# Altium schematic sheet [03] Codec.SchDoc: Codec
size A3; Author: Caner ALP; Organization: ALP Electronics; Address1: Axel Oxenstiernas; Address2: Västerås; Address3: 72478; Address4: Sweden; DocumentNumber: 4; SheetNumber: 4; SheetTotal: 7
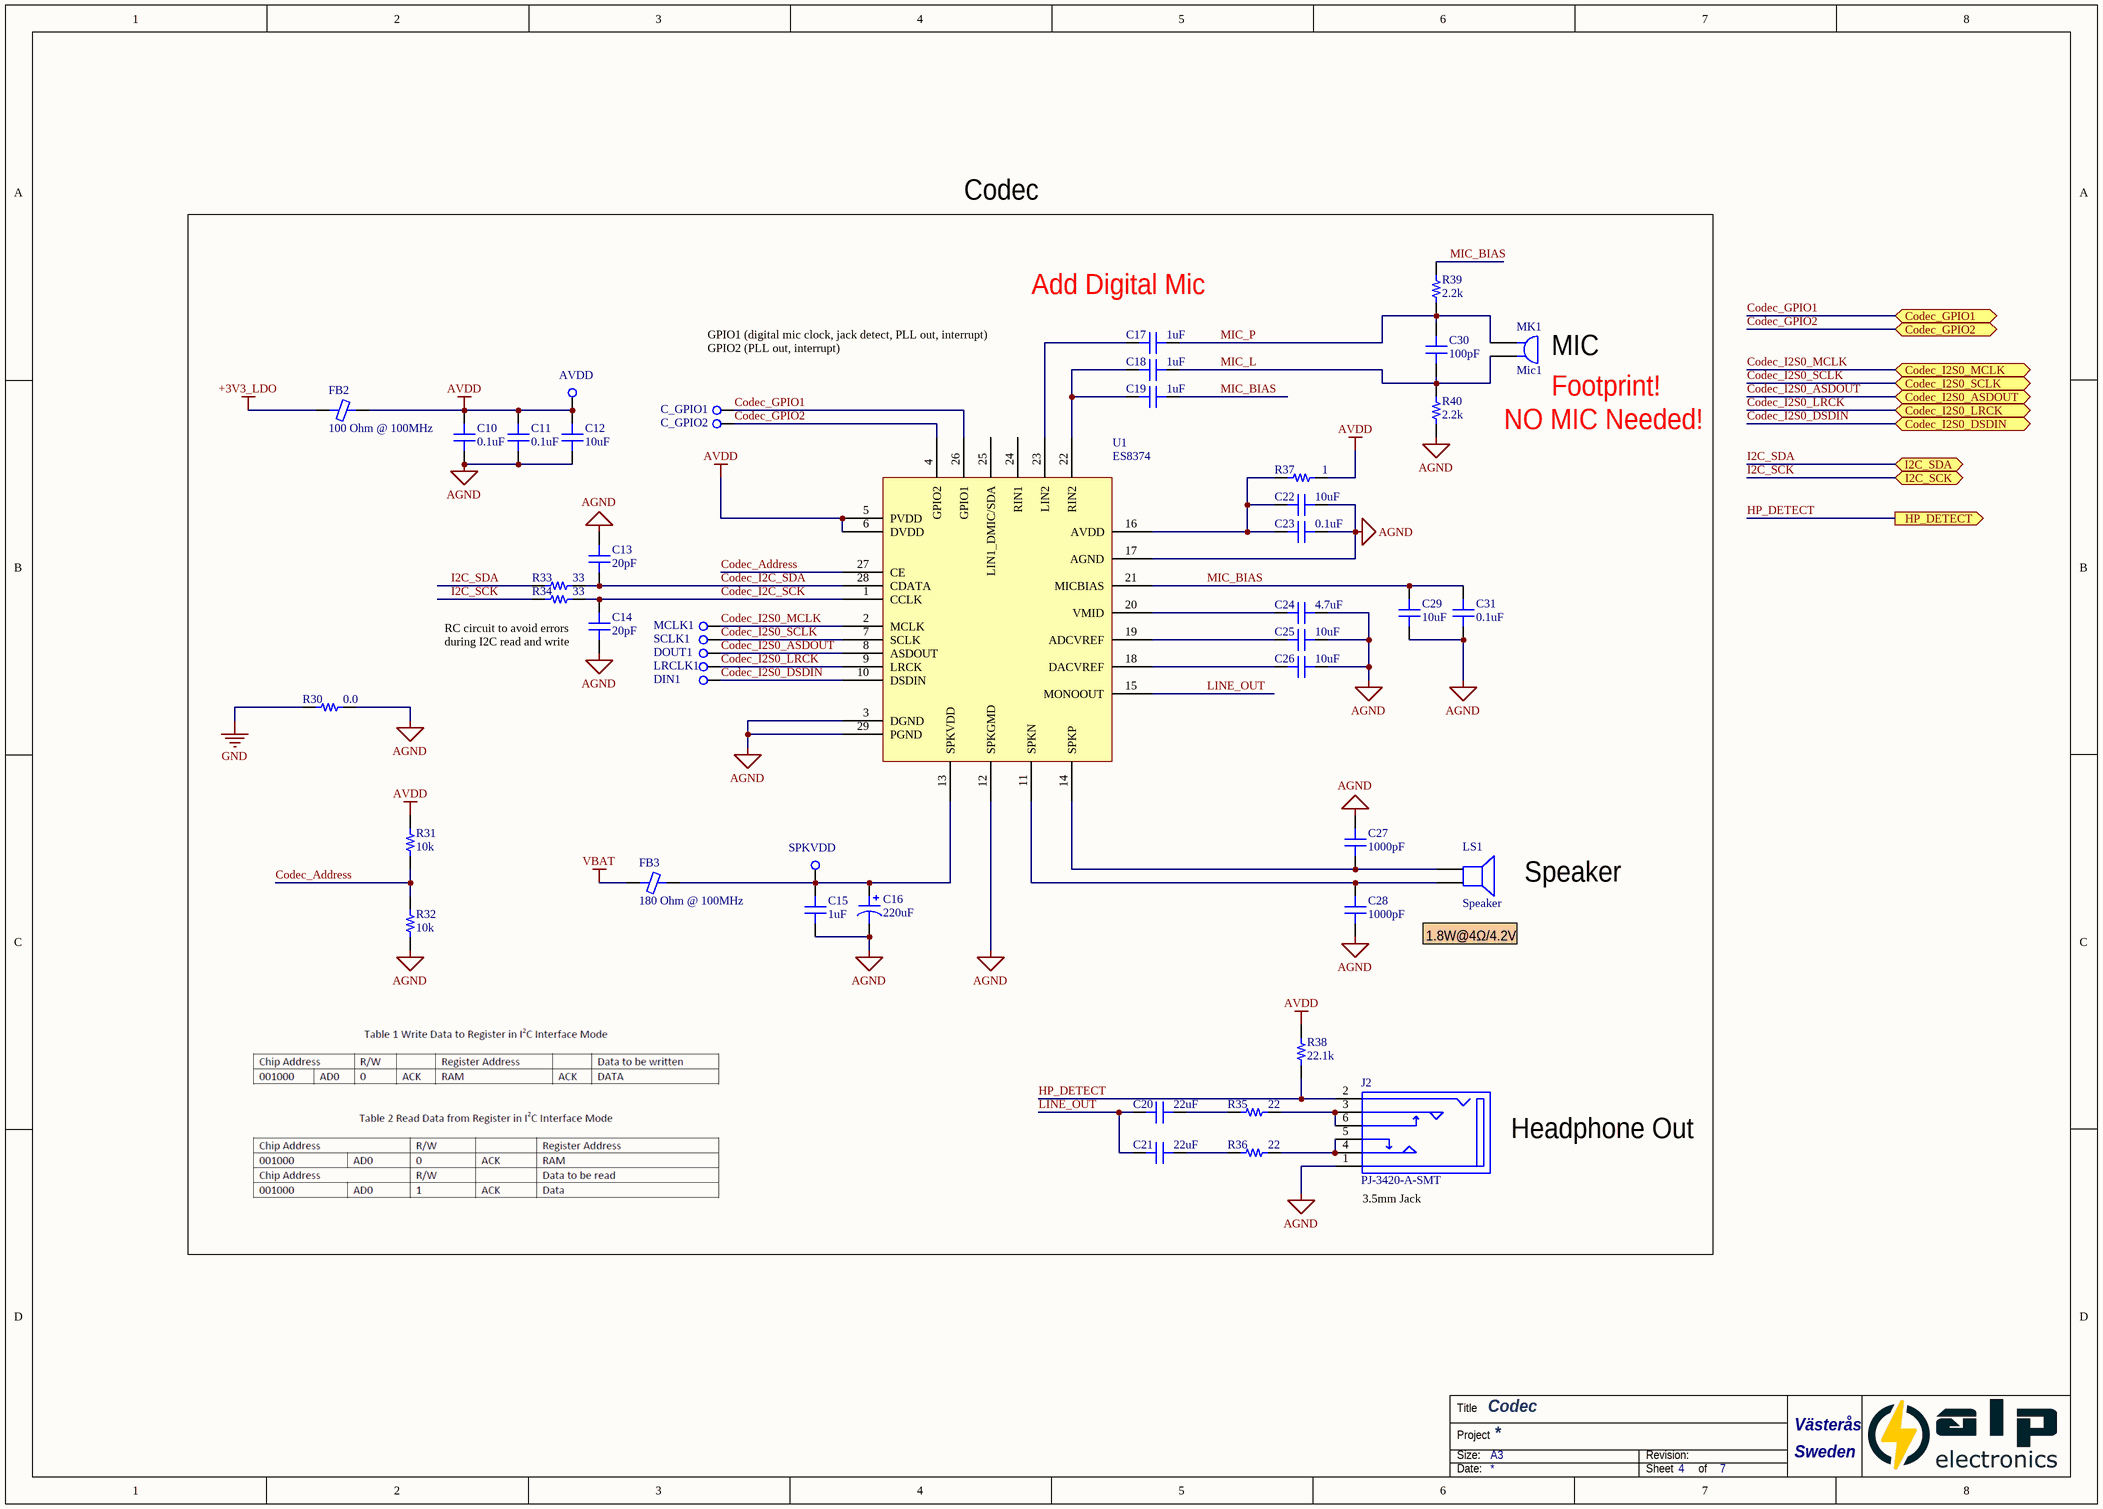
[diagram p0: [03] Codec.SchDoc]

## Parts
AVDD  RCT-0C  [0.5mm-TestPad]  (value not drawn)
C10  0.1uF  [CAP 0603/1608]
C11  0.1uF  [CAP 0603/1608]
C12  10uF  [CAP 0603/1608]
C13  20pF  [CAP 0402/1005]
C14  20pF  [CAP 0402/1005]
C15  1uF  [CAP 0603/1608]
C16  220uF  [CAP ALUM 6.6MM]
C17  1uF  [CAP 0603/1608]
C18  1uF  [CAP 0603/1608]
C19  1uF  [CAP 0603/1608]
C20  22uF  [CAP 0603/1608]
C21  22uF  [CAP 0603/1608]
C22  10uF  [CAP 0603/1608]
C23  0.1uF  [CAP 0603/1608]
C24  4.7uF  [CAP 0603/1608]
C25  10uF  [CAP 0603/1608]
C26  10uF  [CAP 0603/1608]
C27  1000pF  [CAP 0603/1608]
C28  1000pF  [CAP 0603/1608]
C29  10uF  [CAP 0603/1608]
C30  100pF  [CAP 0402/1005]
C31  0.1uF  [CAP 0603/1608]
C_GPIO1  RCT-0C  [0.5mm-TestPad]  (value not drawn)
C_GPIO2  RCT-0C  [0.5mm-TestPad]  (value not drawn)
DIN1  RCT-0C  [0.5mm-TestPad]  (value not drawn)
DOUT1  RCT-0C  [0.5mm-TestPad]  (value not drawn)
FB2  100 Ohm @ 100MHz  [FER 0805/2012]
FB3  180 Ohm @ 100MHz  [FER 0805/2012]
J2  PJ-3420-A-SMT  [PJ-3420-A-SMT]
LRCLK1  RCT-0C  [0.5mm-TestPad]  (value not drawn)
LS1  Speaker  [JST XH B2B-XH-A]
MCLK1  RCT-0C  [0.5mm-TestPad]  (value not drawn)
MK1  Mic1  [HDR1X2]
R30  0.0  [RES 0805/2012]
R31  10k  [RES 0402/1005]
R32  10k  [RES 0402/1005]
R33  33  [RES 0402/1005]
R34  33  [RES 0402/1005]
R35  22  [RES 0603/1608]
R36  22  [RES 0603/1608]
R37  1  [RES 0603/1608]
R38  22.1k  [RES 0402/1005]
R39  2.2k  [RES 0402/1005]
R40  2.2k  [RES 0402/1005]
SCLK1  RCT-0C  [0.5mm-TestPad]  (value not drawn)
SPKVDD  RCT-0C  [0.5mm-TestPad]  (value not drawn)
U1  ES8374  [QFN28 4x4mm 0.4mm Pitch]

## Ports
Codec_GPIO1 (bidir), Codec_GPIO2 (bidir), Codec_I2S0_ASDOUT (bidir), Codec_I2S0_DSDIN (bidir), Codec_I2S0_LRCK (bidir), Codec_I2S0_MCLK (bidir), Codec_I2S0_SCLK (bidir), HP_DETECT (out), I2C_SCK (bidir), I2C_SDA (bidir)

## Nets
+3V3_LDO: FB2.1
AGND: C10.1 C11.1 C12.1 C13.2 C14.1 C15.2 C16.2 C22.2 C23.1 C24.2 C25.2 C26.2 C27.2 C28.1 C29.1 C31.1 J2.1 R30.2 R32.1 R40.1 U1.3(DGND) U1.12(SPKGMD) U1.17(AGND) U1.29(PGND)
AVDD: AVDD.1(TP) C10.2 C11.2 C12.2 FB2.2 R31.2 R37.1 R38.2 U1.5(PVDD) U1.6(DVDD)
GND: R30.1
VBAT: FB3.1
Codec_Address: R31.1 R32.2 U1.27(CE)
Codec_GPIO1: C_GPIO1.1(TP) U1.26(GPIO1) ; port Codec_GPIO1
Codec_GPIO2: C_GPIO2.1(TP) U1.4(GPIO2) ; port Codec_GPIO2
Codec_I2C_SCK: C14.2 R34.2 U1.1(CCLK)
Codec_I2C_SDA: C13.1 R33.2 U1.28(CDATA)
Codec_I2S0_ASDOUT: DOUT1.1(TP) U1.8(ASDOUT) ; port Codec_I2S0_ASDOUT
Codec_I2S0_DSDIN: DIN1.1(TP) U1.10(DSDIN) ; port Codec_I2S0_DSDIN
Codec_I2S0_LRCK: LRCLK1.1(TP) U1.9(LRCK) ; port Codec_I2S0_LRCK
Codec_I2S0_MCLK: MCLK1.1(TP) U1.2(MCLK) ; port Codec_I2S0_MCLK
Codec_I2S0_SCLK: SCLK1.1(TP) U1.7(SCLK) ; port Codec_I2S0_SCLK
HP_DETECT: J2.2 R38.1 ; port HP_DETECT
I2C_SCK: R34.1 ; port I2C_SCK
I2C_SDA: R33.1 ; port I2C_SDA
LINE_OUT: C20.1 C21.1 U1.15(MONOOUT)
MIC_BIAS: C19.1 C29.2 C31.2 R39.2 U1.21(MICBIAS)
MIC_L: C18.1 C30.1 MK1.2 R40.2
MIC_P: C17.1 C30.2 MK1.1 R39.1
NetC15_1: C15.1 C16.1 FB3.2 SPKVDD.1(TP) U1.13(SPKVDD)
NetC17_2: C17.2 U1.23(LIN2)
NetC18_2: C18.2 C19.2 U1.22(RIN2)
NetC20_2: C20.2 R35.1
NetC21_2: C21.2 R36.1
NetC22_1: C22.1 C23.2 R37.2 U1.16(AVDD)
NetC24_1: C24.1 U1.20(VMID)
NetC25_1: C25.1 U1.19(ADCVREF)
NetC26_1: C26.1 U1.18(DACVREF)
NetC27_1: C27.1 LS1.1 U1.14(SPKP)
NetC28_2: C28.2 LS1.2 U1.11(SPKN)
NetJ2_3: J2.3 J2.6 R35.2
NetJ2_4: J2.4 J2.5 R36.2

Not connected (* = marked no-connect by the designer): U1 24(RIN1) 25(LIN1_DMIC/SDA)

## Notes on the sheet
- Codec
- (near C17) Add Digital Mic
- GPIO1 (digital mic clock, jack detect, PLL out, interrupt)
- GPIO2 (PLL out, interrupt)
- (near MK1) MIC
- NO MIC Needed!
- (near MK1) Footprint!
- RC circuit to avoid errors
  during I2C read and write
- Speaker
- (near LS1) 1.8W@4Ω/4.2V
- Headphone Out
- (near J2) 3.5mm Jack
- Title
- Size:
- Project
- A3
- Revision:
- Date:
- Sheet
- of

## Library data of the parts
AVDD C_GPIO1 C_GPIO2 DIN1 DOUT1 LRCLK1 MCLK1 SCLK1 SPKVDD = RCT-0C: 0805 PROBE PAD; Manufacturer: TE Connectivity AMP Connectors; Part Number: RCT-0C; PartId: 15704; Supplier 1: Digi-Key; Supplier Part Number 1: A106144CT-ND; ComponentLink1Description: Datasheet; ComponentLink1URL: http://www.te.com/commerce/DocumentDelivery/DDEController?Action=srchrtrv&DocNm=1773266&DocType=DS&DocLang=English; ComponentLink2Description: Digi-Key Listing; ComponentLink2URL: http://www.digikey.com/product-detail/en/te-connectivity-amp-connectors/RCT-0C/A106144CT-ND/3477801; Price: 0,14; Type: PC Test Point; Mounting Type: Surface Mount
C10 C11 C23 C31 = CC0603KPX7R7BB104: CAP CER 0.1UF 16V X7R 0603; Manufacturer: Yageo; TemperatureRange: -55C ~ 125C; Tolerance: 10%; Value: 0.1uF; Part Number: CC0603KPX7R7BB104; PartId: 5262; Supplier 1: Digi-Key; Supplier Part Number 1: 311-1335-2-ND; ComponentLink1Description: Datasheet; ComponentLink1URL: http://www.yageo.com/documents/recent/UPY-GPHC_X7R_6.3V-to-50V-v12.pdf; ComponentLink2Description: Digi-Key listing; ComponentLink2URL: http://digikey.com/product-detail/en/CC0603KPX7R7BB104/311-1335-2-ND/2103073; TemperatureCoefficient: X7R; Voltage: 16V; Price: 0,0043; Type: -; Device Package: 0603 (1608 Metric)
C12 C22 C25 C26 C29 = C1608X5R1A106M080AC: CAP CER 10UF 10V X5R 0603; Manufacturer: TDK Corporation; TemperatureRange: -55C ~ 85C; Tolerance: 20%; Value: 10uF; Part Number: C1608X5R1A106M080AC; PartId: 13099; Supplier 1: Digi-Key; Supplier Part Number 1: 445-6853-2-ND; ComponentLink1Description: Datasheet; ComponentLink1URL: https://product.tdk.com/info/en/catalog/datasheets/mlcc_commercial_general_en.pdf; ComponentLink2Description: Digi-Key Listing; ComponentLink2URL: https://www.digikey.com/product-detail/en/tdk-corporation/C1608X5R1A106M080AC/445-6853-2-ND/2619194; TemperatureCoefficient: X5R; Voltage: 10V; Price: 0,0935; Device Package: 0603 (1608 Metric)
C13 C14 = GRM1555C1E200JA01D: CAP CER 20PF 25V NP0 0402; Manufacturer: Murata Electronics North America; TemperatureRange: -55C ~ 125C; TemperatureCoefficient: C0G, NP0; Tolerance: 5%; Value: 20pF; Part Number: GRM1555C1E200JA01D; PartId: 5066; Supplier 1: Digi-Key; Supplier Part Number 1: 490-11364-2-ND; ComponentLink1Description: Datasheet; ComponentLink1URL: http://www.murata.com/~/media/webrenewal/support/library/catalog/products/capacitor/mlcc/c02e.ashx; ComponentLink2Description: Digi-Key listing; ComponentLink2URL: http://digikey.com/product-detail/en/GRM1555C1E200JA01D/490-11364-2-ND/3693725; Voltage: 25V; Price: 0,0118; Type: -; Device Package: 0402 (1005 Metric)
C15 C17-C19 = CGB3B1X7R1A105K055AC: CAP CER 1UF 10V X7R 0603; Manufacturer: TDK Corporation; TemperatureRange: -55C ~ 125C; Tolerance: 10%; Type: Low Profile; Value: 1uF; Part Number: CGB3B1X7R1A105K055AC; PartId: 4131; Supplier 1: Digi-Key; Supplier Part Number 1: 445-13228-1-ND; ComponentLink1Description: Datasheet; ComponentLink1URL: https://product.tdk.com/info/en/catalog/datasheets/mlcc_commercial_lowprofile_en.pdf; ComponentLink2Description: Digi-Key listing; ComponentLink2URL: http://digikey.com/product-detail/en/CGB3B1X7R1A105K055AC/445-13228-1-ND/3954894; TemperatureCoefficient: X7R; Voltage: 10V; Price: 0,27; Device Package: 0603 (1608 Metric)
C16 = EEE-1CA221XP: CAP ALUM 220UF 20% 16V SMD; Manufacturer: Panasonic Electronic Components; TemperatureRange: -40C ~ 85C; Type: Automotive; Ripple Current: 162mA; Lifetime @ Temp: 2000 Hrs @ 85C; Value: 220uF; Part Number: EEE-1CA221XP; PartId: 7248; Supplier 1: Digi-Key; Supplier Part Number 1: PCE3885TR-ND; ComponentLink1Description: Datasheet; ComponentLink1URL: http://media.digikey.com/pdf/Data%20Sheets/Panasonic%20Electronic%20Components/S_Series_Type_V.pdf; ComponentLink2Description: Digi-Key listing; ComponentLink2URL: http://digikey.com/product-detail/en/EEE-1CA221XP/PCE3885TR-ND/766052; Tolerance: 20%; Voltage: 16V; Price: 0,1758; Device Package: Radial, Can - SMD; Impedance: -
C20 C21 = C1608X5R1A226M080AC: CAP CER 22UF 10V X5R 0603; Manufacturer: TDK Corporation; TemperatureRange: -55C ~ 85C; Tolerance: 20%; Value: 22uF; Part Number: C1608X5R1A226M080AC; PartId: 12987; Supplier 1: Digi-Key; Supplier Part Number 1: 445-9077-2-ND; ComponentLink1Description: Datasheet; ComponentLink1URL: https://product.tdk.com/info/en/catalog/datasheets/mlcc_commercial_general_en.pdf; ComponentLink2Description: Digi-Key Listing; ComponentLink2URL: https://www.digikey.com/product-detail/en/tdk-corporation/C1608X5R1A226M080AC/445-9077-2-ND/3661560; TemperatureCoefficient: X5R; Voltage: 10V; Price: 0,105; Device Package: 0603 (1608 Metric)
C24 = C1608X5R1A475K080AC: CAP CER 4.7UF 10V X5R 0603; Manufacturer: TDK Corporation; TemperatureRange: -55C ~ 85C; Tolerance: 10%; Value: 4.7uF; Part Number: C1608X5R1A475K080AC; PartId: 13010; Supplier 1: Digi-Key; Supplier Part Number 1: 445-5170-2-ND; ComponentLink1Description: Datasheet; ComponentLink1URL: https://product.tdk.com/info/en/catalog/datasheets/mlcc_commercial_general_en.pdf; ComponentLink2Description: Digi-Key Listing; ComponentLink2URL: https://www.digikey.com/product-detail/en/tdk-corporation/C1608X5R1A475K080AC/445-5170-2-ND/2093438; TemperatureCoefficient: X5R; Voltage: 10V; Price: 0,0333; Device Package: 0603 (1608 Metric)
C27 C28 = C0603C102K3RACTU: CAP CER 1000PF 25V X7R 0603; Manufacturer: Kemet; TemperatureRange: -55C ~ 125C; Tolerance: 10%; Value: 1000pF; Part Number: C0603C102K3RACTU; PartId: 13145; Supplier 1: Digi-Key; Supplier Part Number 1: 399-7834-2-ND; ComponentLink1Description: Datasheet; ComponentLink1URL: http://www.kemet.com/docfinder?Partnumber=C0603C102K3RACTU; ComponentLink2Description: Digi-Key Listing; ComponentLink2URL: https://www.digikey.com/product-detail/en/kemet/C0603C102K3RACTU/399-7834-2-ND/2199718; TemperatureCoefficient: X7R; Voltage: 25V; Price: 0,0041; Device Package: 0603 (1608 Metric)
C30 = C0402C101J3GACTU: CAP CER 100PF 25V NP0 0402; Manufacturer: Kemet; TemperatureRange: -55C ~ 125C; TemperatureCoefficient: C0G, NP0; Tolerance: 5%; Value: 100pF; Part Number: C0402C101J3GACTU; PartId: 12375; Supplier 1: Digi-Key; Supplier Part Number 1: 399-1022-2-ND; ComponentLink1Description: Datasheet; ComponentLink1URL: http://www.kemet.com/docfinder?Partnumber=C0402C101J3GACTU; ComponentLink2Description: Digi-Key Listing; ComponentLink2URL: https://www.digikey.com/product-detail/en/kemet/C0402C101J3GACTU/399-1022-2-ND/411024; Voltage: 25V; Price: 0,0046; Device Package: 0402 (1005 Metric)
FB2 = CIC21P101NE: FERRITE CHIP 100 OHM 2000MA 0805; Manufacturer: Samsung Electro-Mechanics America, Inc.; Type: Differential Mode - Single; DC Resistance: 20 mOhm Max; Current Rating: 2A; Part Number: CIC21P101NE; PartId: 6759; Value: 100 Ohm @ 100MHz; Supplier 1: Digi-Key; Supplier Part Number 1: 1276-6374-2-ND; ComponentLink1Description: Datasheet; ComponentLink1URL: http://www.samsungsem.com/kr/front/downloadcms.do?path=/kr/support/product-search/bead/__icsFiles/afieldfile/2014/11/13&fileName=S_CIC21J121NE.pdf; ComponentLink2Description: Digi-Key listing; ComponentLink2URL: http://digikey.com/product-detail/en/CIC21P101NE/1276-6374-2-ND/3973735; Price: 0,0163; Device Package: 0805 (2012 Metric)
FB3 = MMZ2012S181AT000: FERRITE CHIP 180 OHM 600MA 0805; Manufacturer: TDK Corporation; Type: Differential Mode - Single; DC Resistance: 150 mOhm Max; Part Number: MMZ2012S181AT000; PartId: 6805; Value: 180 Ohm @ 100MHz; Supplier 1: Digi-Key; Supplier Part Number 1: 445-2194-2-ND; ComponentLink1Description: Datasheet; ComponentLink1URL: https://product.tdk.com/info/en/catalog/datasheets/beads_commercial_signal_mmz2012_en.pdf; ComponentLink2Description: Digi-Key listing; ComponentLink2URL: http://digikey.com/product-detail/en/MMZ2012S181AT000/445-2194-2-ND/600551; Price: 0,0344; Device Package: 0805 (2012 Metric); Current Rating: 600mA
LS1 = Speaker: Loudspeaker; Published: 24-Mar-1999; LatestRevisionDate: 17-Jul-2002; LatestRevisionNote: Re-released for DXP Platform.; PackageReference: PIN2; Publisher: Altium Limited
MK1 = Mic1: Microphone; Published: 24-Mar-1999; LatestRevisionDate: 17-Jul-2002; LatestRevisionNote: Re-released for DXP Platform.; PackageReference: PIN2; Publisher: Altium Limited
R30 = CR0805-J/-000ELF: RES SMD 0.0 OHM JUMPER 1/8W 0805; Manufacturer: Bourns Inc.; TemperatureRange: -55C ~ 155C; PowerRating: 0.125W, 1/8W; Value: 0.0; Part Number: CR0805-J/-000ELF; PartId: 16155; Supplier 1: Digi-Key; Supplier Part Number 1: CR0805-J/-000ELFTR-ND; ComponentLink1Description: Datasheet; ComponentLink1URL: http://www.bourns.com/docs/Product-Datasheets/CHPREZTR.pdf; ComponentLink2Description: Digi-Key Listing; ComponentLink2URL: https://www.digikey.com/product-detail/en/bourns-inc/CR0805-J%2F-000ELF/CR0805-J%2F-000ELFTR-ND/3593157; Tolerance: Jumper; Price: 0,011; Device Package: 0805 (2012 Metric)
R31 R32 = RC0402JR-0710KL: RES SMD 10K OHM 5% 1/16W 0402; Manufacturer: Yageo; TemperatureRange: -55C ~ 155C; TemperatureCoefficient: 100ppm/C; PowerRating: 0.063W, 1/16W; Value: 10k; Part Number: RC0402JR-0710KL; PartId: 14464; Supplier 1: Digi-Key; Supplier Part Number 1: 311-10KJRTR-ND; ComponentLink1Description: Datasheet; ComponentLink1URL: http://www.yageo.com/documents/recent/PYu-RC_Group_51_RoHS_L_04.pdf; ComponentLink2Description: Digi-Key Listing; ComponentLink2URL: https://www.digikey.com/product-detail/en/yageo/RC0402JR-0710KL/311-10KJRTR-ND/726418; Tolerance: 5%; Price: 0,0017; Device Package: 0402 (1005 Metric)
R33 R34 = ERJ-2GEJ330X: RES SMD 33 OHM 5% 1/10W 0402; Manufacturer: Panasonic Electronic Components; TemperatureRange: -55C ~ 155C; TemperatureCoefficient: 200ppm/C; PowerRating: 0.1W, 1/10W; Value: 33; Part Number: ERJ-2GEJ330X; PartId: 10984; Supplier 1: Digi-Key; Supplier Part Number 1: P33JTR-ND; ComponentLink1Description: Datasheet; ComponentLink1URL: http://industrial.panasonic.com/www-cgi/jvcr13pz.cgi?E+PZ+3+AOA0001+ERJ2GEJ330X+7+WW; ComponentLink2Description: Digi-Key Listing; ComponentLink2URL: https://www.digikey.com/product-detail/en/panasonic-electronic-components/ERJ-2GEJ330X/P33JTR-ND/146980; Tolerance: 5%; Price: 0,0019; Device Package: 0402 (1005 Metric)
R35 R36 = ERJ-3GEYJ220V: RES SMD 22 OHM 5% 1/10W 0603; Manufacturer: Panasonic Electronic Components; TemperatureRange: -55C ~ 155C; TemperatureCoefficient: 200ppm/C; PowerRating: 0.1W, 1/10W; Value: 22; Part Number: ERJ-3GEYJ220V; PartId: 11193; Supplier 1: Digi-Key; Supplier Part Number 1: P22GTR-ND; ComponentLink1Description: Datasheet; ComponentLink1URL: http://industrial.panasonic.com/www-cgi/jvcr13pz.cgi?E+PZ+3+AOA0001+ERJ3GEYJ220V+7+WW; ComponentLink2Description: Digi-Key Listing; ComponentLink2URL: https://www.digikey.com/product-detail/en/panasonic-electronic-components/ERJ-3GEYJ220V/P22GTR-ND/135600; Tolerance: 5%; Price: 0,002; Device Package: 0603 (1608 Metric)
R37 = ERJ-3GEYJ1R0V: RES SMD 1 OHM 5% 1/10W 0603; Manufacturer: Panasonic Electronic Components; TemperatureRange: -55C ~ 155C; TemperatureCoefficient: -100/ +600ppm/C; PowerRating: 0.1W, 1/10W; Value: 1; Part Number: ERJ-3GEYJ1R0V; PartId: 11204; Supplier 1: Digi-Key; Supplier Part Number 1: P1.0GTR-ND; ComponentLink1Description: Datasheet; ComponentLink1URL: http://industrial.panasonic.com/www-cgi/jvcr13pz.cgi?E+PZ+3+AOA0001+ERJ3GEYJ1R0V+7+WW; ComponentLink2Description: Digi-Key Listing; ComponentLink2URL: https://www.digikey.com/product-detail/en/panasonic-electronic-components/ERJ-3GEYJ1R0V/P1.0GTR-ND/282111; Tolerance: 5%; Price: 0,002; Device Package: 0603 (1608 Metric)
R38 = ERJ-2RKF2212X: RES SMD 22.1K OHM 1% 1/10W 0402; Manufacturer: Panasonic Electronic Components; TemperatureRange: -55C ~ 155C; TemperatureCoefficient: 100ppm/C; PowerRating: 0.1W, 1/10W; Value: 22.1k; Part Number: ERJ-2RKF2212X; PartId: 234; Supplier 1: Digi-Key; Supplier Part Number 1: P22.1KLTR-ND; ComponentLink1Description: Datasheet; ComponentLink1URL: http://industrial.panasonic.com/www-cgi/jvcr13pz.cgi?E+PZ+3+AOA0002+ERJ2RKF2212X+7+WW; ComponentLink2Description: Digikey listing; ComponentLink2URL: http://digikey.com/product-detail/en/ERJ-2RKF2212X/P22.1KLTR-ND/192228; Tolerance: 1%; Price: 0,0043; Type: Thick Film; Device Package: 0402 (1005 Metric)
R39 R40 = RC0402JR-072K2L: RES SMD 2.2K OHM 5% 1/16W 0402; Manufacturer: Yageo; TemperatureRange: -55C ~ 155C; TemperatureCoefficient: 100ppm/C; PowerRating: 0.063W, 1/16W; Value: 2.2k; Part Number: RC0402JR-072K2L; PartId: 14475; Supplier 1: Digi-Key; Supplier Part Number 1: 311-2.2KJRTR-ND; ComponentLink1Description: Datasheet; ComponentLink1URL: http://www.yageo.com/documents/recent/PYu-RC_Group_51_RoHS_L_04.pdf; ComponentLink2Description: Digi-Key Listing; ComponentLink2URL: https://www.digikey.com/product-detail/en/yageo/RC0402JR-072K2L/311-2.2KJRTR-ND/726436; Tolerance: 5%; Price: 0,0017; Device Package: 0402 (1005 Metric)
U1 = ES8374: IC AMP AUDIO CODEC  1.8W QFN28; Manufacturer: Evereset Semi; Output Type: 1-Channel (Mono); Max Output Power x Channels @ Load: 1.8W x1 @ 4Ω 4.2V; Voltage Supply: 3.3 V ~ 5 V; Part Number: ES8374; PartId: 9316; Supplier 1: LCSC; Supplier Part Number 1: ES8374; ComponentLink1Description: Datasheet; ComponentLink1URL: https://datasheet.lcsc.com/szlcsc/1912111437_Everest-semi-Everest-Semiconductor-ES8374_C365738.pdf; ComponentLink2Description: LCSC Listing; ComponentLink2URL: https://lcsc.com/product-detail/Codec-ICs_Everest-Semiconductor-ES8374_C365738.html; Type: Class D; Device Package: 28-QFN; Operating Temperature: -40C ~ 85C (TA)